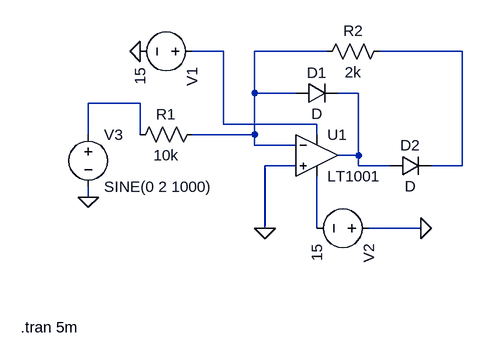
[diagram p0: schematic Draft4.asc]
Draft4.asc, the LTspice schematic file:
Version 4.1
SHEET 1 880 680
WIRE 224 48 176 48
WIRE 384 48 272 48
WIRE 592 48 464 48
WIRE 272 112 272 48
WIRE 336 112 272 112
WIRE 432 112 400 112
WIRE 96 128 16 128
WIRE 224 160 224 48
WIRE 368 160 224 160
WIRE 16 176 16 128
WIRE 96 176 96 128
WIRE 272 176 272 112
WIRE 272 176 176 176
WIRE 368 176 368 160
WIRE 272 192 272 176
WIRE 336 192 272 192
WIRE 432 208 432 112
WIRE 432 208 400 208
WIRE 336 224 288 224
WIRE 432 224 432 208
WIRE 480 224 432 224
WIRE 592 224 592 48
WIRE 592 224 544 224
WIRE 16 272 16 256
WIRE 288 320 288 224
WIRE 368 320 368 240
WIRE 528 320 448 320
FLAG 288 320 0
FLAG 96 48 0
FLAG 16 272 0
FLAG 528 320 0
SYMBOL res 192 160 R90
WINDOW 0 0 56 VBottom 2
WINDOW 3 32 56 VTop 2
SYMATTR InstName R1
SYMATTR Value 10k
SYMBOL res 480 32 R90
WINDOW 0 0 56 VBottom 2
WINDOW 3 32 56 VTop 2
SYMATTR InstName R2
SYMATTR Value 2k
SYMBOL diode 336 128 R270
WINDOW 0 32 32 VTop 2
WINDOW 3 0 32 VBottom 2
SYMATTR InstName D1
SYMBOL diode 480 240 R270
WINDOW 0 32 32 VTop 2
WINDOW 3 0 32 VBottom 2
SYMATTR InstName D2
SYMBOL OpAmps\\LT1001 368 144 R0
SYMATTR InstName U1
SYMBOL voltage 192 48 R90
WINDOW 123 0 0 Left 0
WINDOW 39 0 0 Left 0
SYMATTR InstName V1
SYMATTR Value 15
SYMBOL voltage 464 320 R90
WINDOW 123 0 0 Left 0
WINDOW 39 0 0 Left 0
SYMATTR InstName V2
SYMATTR Value 15
SYMBOL voltage 16 160 R0
WINDOW 123 0 0 Left 0
WINDOW 39 0 0 Left 0
SYMATTR InstName V3
SYMATTR Value SINE(0 2 1000)
TEXT -88 472 Left 2 !.tran 5m

The netlist it stands for:
* Draft4.asc
R1 N002 N005 10k
R2 N003 N002 2k
D1 N002 N004 D
D2 N004 N003 D
X§U1 0 N002 N001 N006 N004 LT1001  ; pins In+ In- V+ V- OUT
V1 N001 0 15
V2 0 N006 15
V3 N005 0 SINE(0 2 1000)
.model D D
.lib standard.dio
.tran 5m
.lib LTC.lib
.backanno
.end